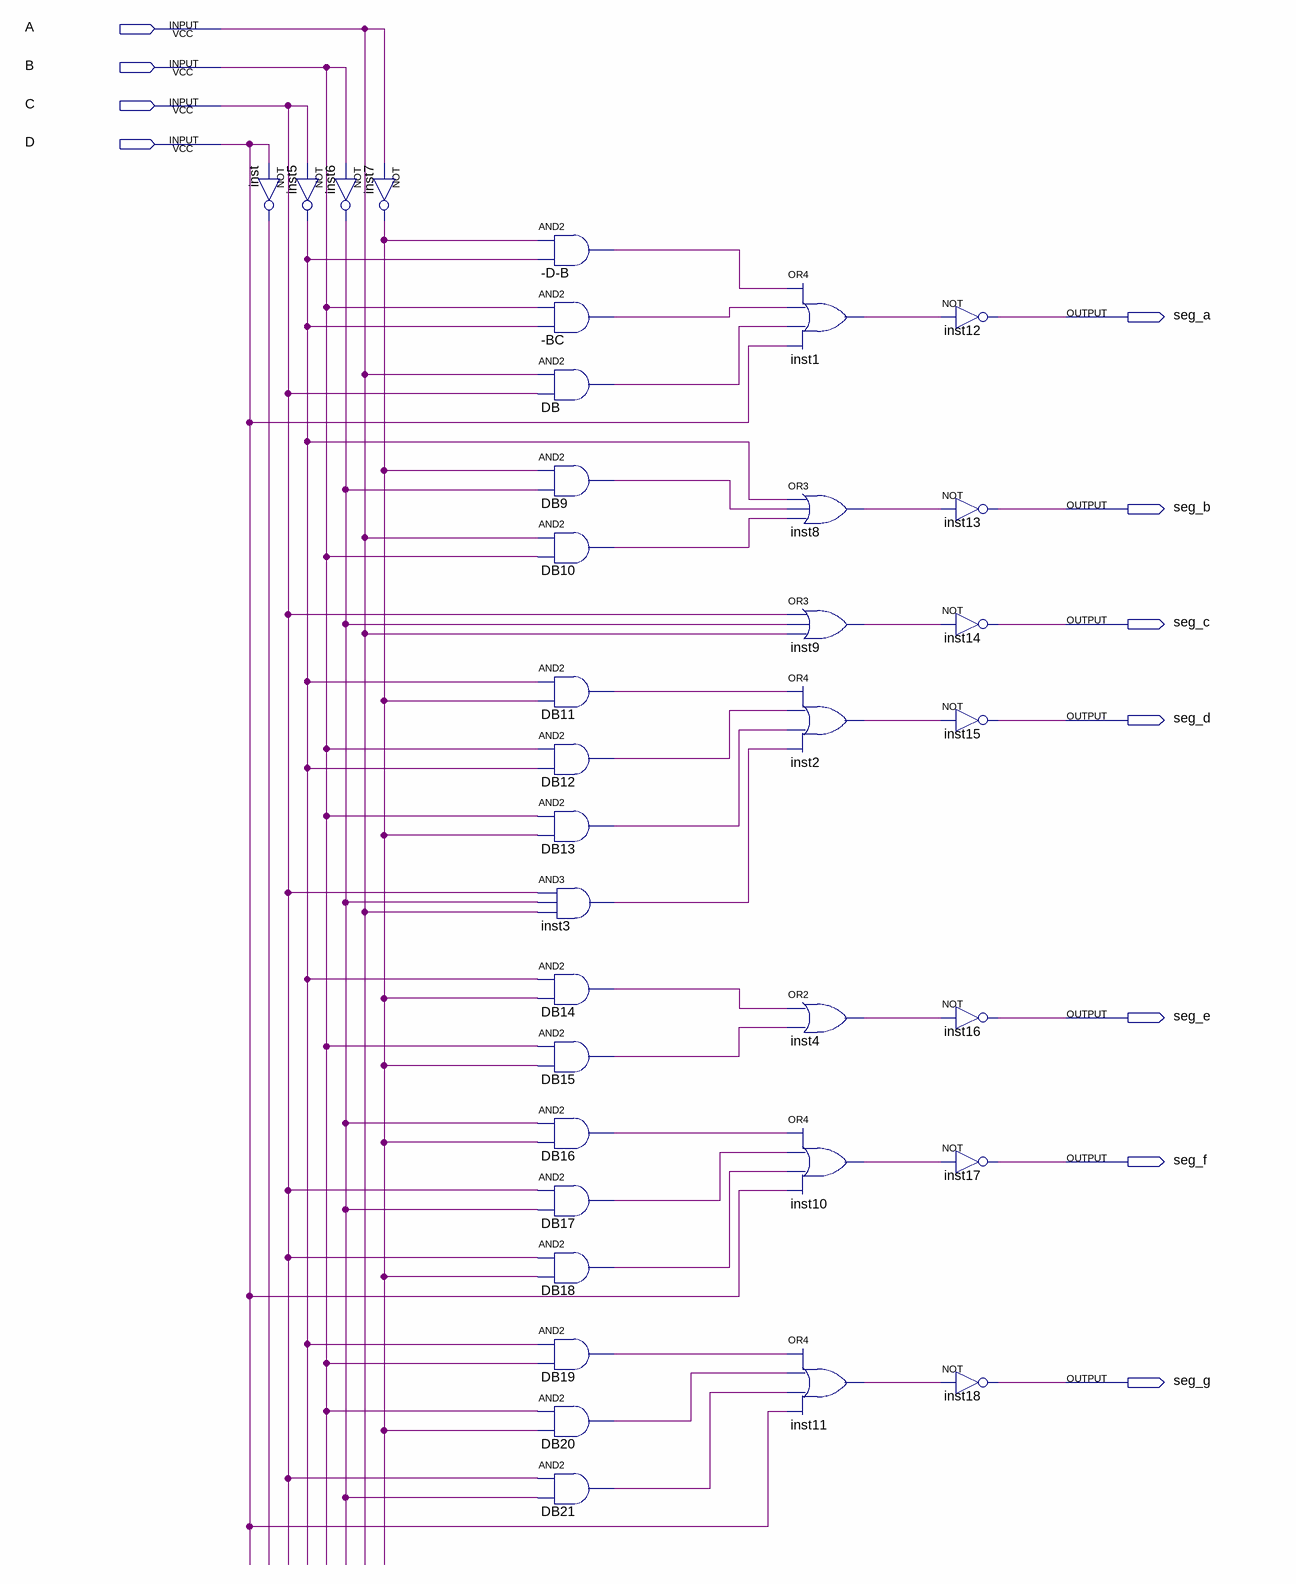
[diagram p0: schematic sheet]
// Quartus schematic 7seg.bdf as structural Verilog: 35 symbols, 11 pins
module \7seg  (
  input  A,
  input  B,
  input  C,
  input  D,
  output seg_a,
  output seg_b,
  output seg_c,
  output seg_d,
  output seg_e,
  output seg_f,
  output seg_g
);

  wire _BC_out, _D_B_out, DB9_out, DB10_out, DB11_out, DB12_out, DB13_out, DB14_out, DB15_out, DB16_out,
       DB17_out, DB18_out, DB19_out, DB20_out, DB21_out, DB_out, inst1_out, inst2_out, inst3_out, inst4_out,
       inst5_out, inst6_out, inst7_out, inst8_out, inst9_out, inst10_out, inst11_out, inst_out;

  not inst (inst_out, D);
  not inst5 (inst5_out, C);
  not inst6 (inst6_out, B);
  not inst7 (inst7_out, A);
  and \u_-D-B  (_D_B_out, inst7_out, inst5_out);
  and \u_-BC  (_BC_out, B, inst5_out);
  and DB (DB_out, A, C);
  and DB9 (DB9_out, inst7_out, inst6_out);
  and DB10 (DB10_out, A, B);
  and DB11 (DB11_out, inst5_out, inst7_out);
  and DB12 (DB12_out, B, inst5_out);
  and DB13 (DB13_out, B, inst7_out);
  and inst3 (inst3_out, C, inst6_out, A);
  and DB14 (DB14_out, inst5_out, inst7_out);
  and DB15 (DB15_out, B, inst7_out);
  and DB16 (DB16_out, inst6_out, inst7_out);
  and DB17 (DB17_out, C, inst6_out);
  and DB18 (DB18_out, C, inst7_out);
  and DB19 (DB19_out, inst5_out, B);
  and DB20 (DB20_out, B, inst7_out);
  and DB21 (DB21_out, C, inst6_out);
  or inst1 (inst1_out, _D_B_out, _BC_out, DB_out, D);
  or inst8 (inst8_out, inst5_out, DB9_out, DB10_out);
  or inst9 (inst9_out, C, inst6_out, A);
  or inst2 (inst2_out, DB11_out, DB12_out, DB13_out, inst3_out);
  or inst4 (inst4_out, DB14_out, DB15_out);
  or inst10 (inst10_out, DB16_out, DB17_out, DB18_out, D);
  or inst11 (inst11_out, DB19_out, DB20_out, DB21_out, D);
  not inst12 (seg_a, inst1_out);
  not inst13 (seg_b, inst8_out);
  not inst14 (seg_c, inst9_out);
  not inst15 (seg_d, inst2_out);
  not inst16 (seg_e, inst4_out);
  not inst17 (seg_f, inst10_out);
  not inst18 (seg_g, inst11_out);
endmodule
